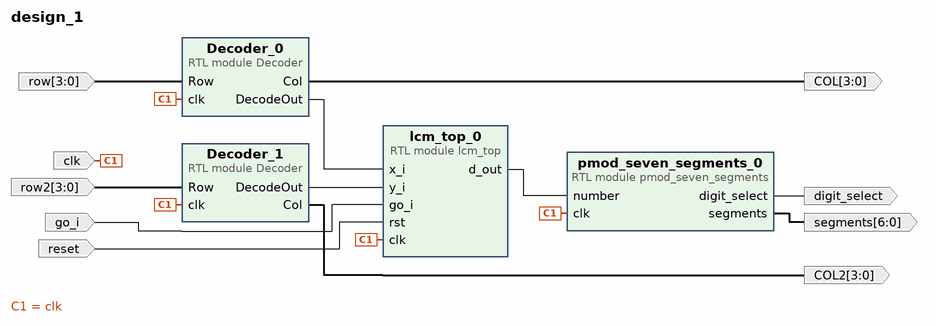
[diagram p0: block diagram of the top level]
# Vivado block design design_1, xc7z010clg400-1, Vivado 2022.1
create_bd_design design_1

create_bd_port -dir I clk
create_bd_port -dir I reset
create_bd_port -dir I go_i
create_bd_port -dir O digit_select
create_bd_port -dir O -from 6 -to 0 segments
create_bd_port -dir O -from 3 -to 0 COL
create_bd_port -dir O -from 3 -to 0 COL2
create_bd_port -dir I -from 3 -to 0 row
create_bd_port -dir I -from 3 -to 0 row2

create_bd_cell -type module -reference lcm_top lcm_top_0
create_bd_cell -type module -reference Decoder Decoder_0
create_bd_cell -type module -reference Decoder Decoder_1
create_bd_cell -type module -reference pmod_seven_segments pmod_seven_segments_0

# ---- connections ----

connect_bd_net [get_bd_pins Decoder_0/Col] [get_bd_ports COL]
connect_bd_net [get_bd_pins Decoder_0/DecodeOut] [get_bd_pins lcm_top_0/x_i]
connect_bd_net [get_bd_pins Decoder_1/Col] [get_bd_ports COL2]
connect_bd_net [get_bd_pins Decoder_1/DecodeOut] [get_bd_pins lcm_top_0/y_i]
connect_bd_net [get_bd_ports clk] \
  [get_bd_pins Decoder_0/clk] [get_bd_pins Decoder_1/clk] [get_bd_pins lcm_top_0/clk] [get_bd_pins pmod_seven_segments_0/clk]
connect_bd_net [get_bd_ports go_i] [get_bd_pins lcm_top_0/go_i]
connect_bd_net [get_bd_pins lcm_top_0/d_out] [get_bd_pins pmod_seven_segments_0/number]
connect_bd_net [get_bd_pins pmod_seven_segments_0/digit_select] [get_bd_ports digit_select]
connect_bd_net [get_bd_pins pmod_seven_segments_0/segments] [get_bd_ports segments]
connect_bd_net [get_bd_ports reset] [get_bd_pins lcm_top_0/rst]
connect_bd_net -net row2_1 [get_bd_ports row2] [get_bd_pins Decoder_1/Row]
connect_bd_net [get_bd_ports row] [get_bd_pins Decoder_0/Row]

validate_bd_design
save_bd_design
